# EAGLE design emonTx V3.4.5 (EAGLE 9.6.2)
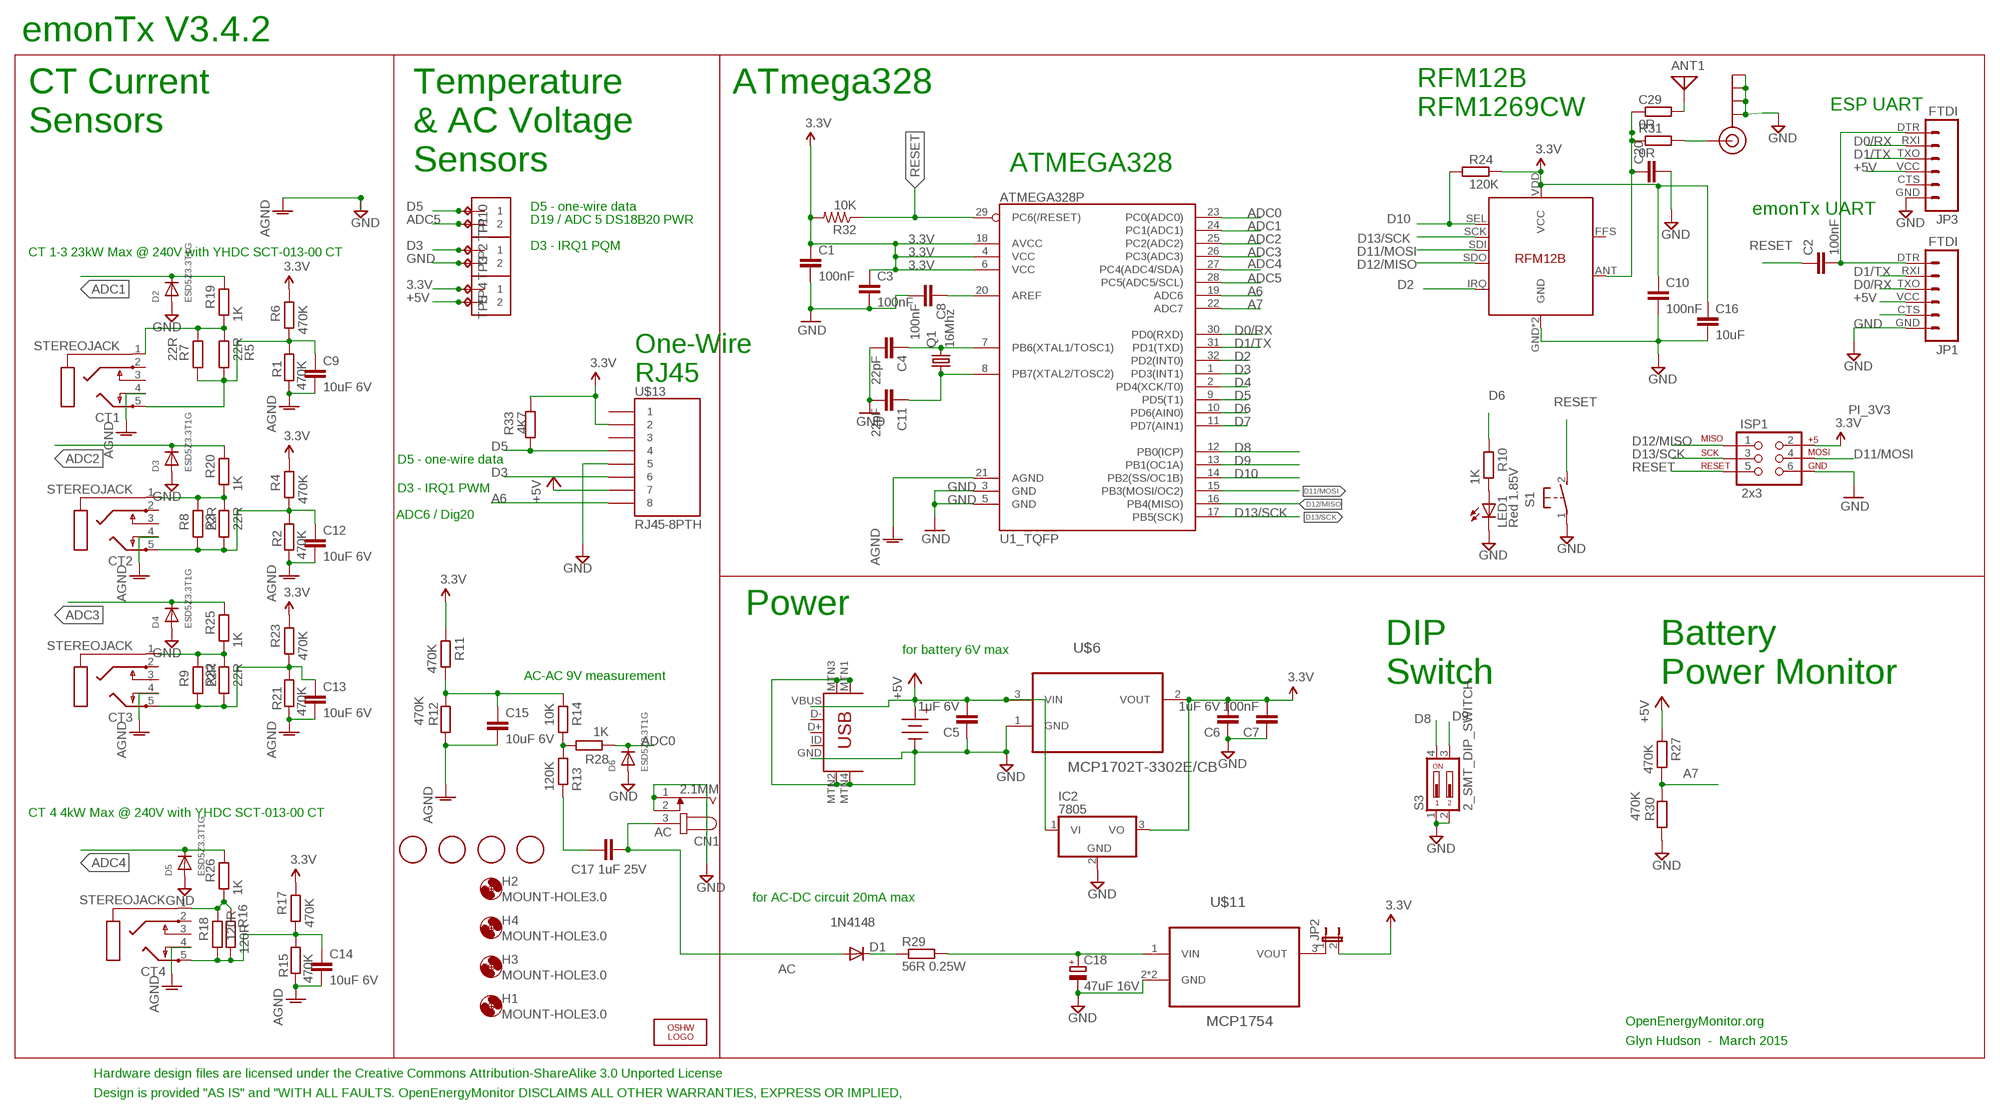
[diagram p0: schematic, sheet 1]

## Parts
ANT1  ANTENNA  [PAD-01]
C1  100nF  C-EUC0603  [C0603]
C2  100nF  C-EUC0603  [C0603]
C3  100nF  C-EUC0603  [C0603]
C4  22pF  C-EUC0603  [C0603]
C5  1uF 6V  C-EUC0603  [C0603]
C6  1uF 6V  C-EUC0603  [C0603]
C7  100nF  C-EUC0603  [C0603]
C8  100nF  C-EUC0603  [C0603]
C9  10uF 6V  C-EUC0603  [C0603]
C10  100nF  C-EUC0603  [C0603]
C11  22pF  C-EUC0603  [C0603]
C12  10uF 6V  C-EUC0603  [C0603]
C13  10uF 6V  C-EUC0603  [C0603]
C14  10uF 6V  C-EUC0603  [C0603]
C15  10uF 6V  C-EUC0603  [C0603]
C16  10uF  C-EUC0603  [C0603]
C17  1uF 25V  C-EUC0603  [C0603]
C18  47uF 16V  CPOL-EUD  [PANASONIC_D]
C20  ant tune?  C-EUC0603  [C0603]
C29  0R  R-EU_R0603  [R0603]
CN1  2.1MM  JACK-PLUG0  [SPC4077]
CT1  STEREOJACK  [STX3100]
CT2  STEREOJACK  [STX3100]
CT3  STEREOJACK  [STX3100]
CT4  STEREOJACK  [STX3100]
D1  1N4148  DIODESOD  [SOD-323]
D2  ESD5Z3.3T1G  DIODESOD-523  [SOD-523]
D3  ESD5Z3.3T1G  DIODESOD-523  [SOD-523]
D4  ESD5Z3.3T1G  DIODESOD-523  [SOD-523]
D5  ESD5Z3.3T1G  DIODESOD-523  [SOD-523]
D6  ESD5Z3.3T1G  DIODESOD-523  [SOD-523]
H1  MOUNT-HOLE3.0  [3,0]
H2  MOUNT-HOLE3.0  [3,0]
H3  MOUNT-HOLE3.0  [3,0]
H4  MOUNT-HOLE3.0  [3,0]
IC2  7805  7812TV  [TO220V]
ISP1  2x3  AVR_SPI_PRG_6PTH  [2X3]
J3  1X2-3.5MM  [1X2-3.5MM]
J5  1X2-3.5MM  [1X2-3.5MM]
J6  1X2-3.5MM  [1X2-3.5MM]
J$1  SMA_EDGE  [SMA-EDGE]
JP1  FTDI  FTDI_BASICPTH  [FTDI_BASIC]
JP2  JUMPER-2PTH_LOCK  [1X02_LOCK]
JP3  FTDI  FTDI_BASICPTH  [FTDI_BASIC]
LED1  Red 1.85V  LEDCHIP-LED0805  [CHIP-LED0805]
LOGO1  OSHW_LOGO_6MILX0200-NT  [OSHW_6X200_NOTEXT]
Q1  16Mhz  CRYSTALHC49UP  [HC49UP]
R1  470K  R-EU_R0603  [R0603]
R2  470K  R-EU_R0603  [R0603]
R3  22R  R-EU_0204/7  [0204/7]
R4  470K  R-EU_R0603  [R0603]
R5  22R  R-EU_0204/7  [0204/7]
R6  470K  R-EU_R0603  [R0603]
R7  22R  R-EU_R1206  [R1206]
R8  22R  R-EU_R1206  [R1206]
R9  22R  R-EU_R1206  [R1206]
R10  1K  R-EU_R0603  [R0603]
R11  470K  R-EU_R0603  [R0603]
R12  470K  R-EU_R0603  [R0603]
R13  120K  R-EU_R0603  [R0603]
R14  10K  R-EU_R0603  [R0603]
R15  470K  R-EU_R0603  [R0603]
R16  120R  R-EU_0204/7  [0204/7]
R17  470K  R-EU_R0603  [R0603]
R18  120R  R-EU_R1206  [R1206]
R19  1K  R-EU_R0603  [R0603]
R20  1K  R-EU_R0603  [R0603]
R21  470K  R-EU_R0603  [R0603]
R22  22R  R-EU_0204/7  [0204/7]
R23  470K  R-EU_R0603  [R0603]
R24  120K  R-EU_R0603  [R0603]
R25  1K  R-EU_R0603  [R0603]
R26  1K  R-EU_R0603  [R0603]
R27  470K  R-EU_R0603  [R0603]
R28  1K  R-EU_R0603  [R0603]
R29  56R 0.25W  R-EU_R1206  [R1206]
R30  470K  R-EU_R0603  [R0603]
R31  0R  R-EU_R0603  [R0603]
R32  10K  R-US_R0603  [R0603]
R33  4K7  R-EU_R0603  [R0603]
S1  31-XX  [B3F-31XX]
S3  2_SMT_DIP_SWITCH  [DIP_SWITCH_SMT]
TP1  TPPAD1-13  [P1-13]
TP2  TPPAD1-13  [P1-13]
TP3  TPPAD1-13  [P1-13]
TP4  TPPAD1-13  [P1-13]
TP5  TPPAD1-13  [P1-13]
TP10  TPPAD1-13  [P1-13]
U1_TQFP  ATMEGA328P  ATMEGA328_SMT  [TQFP32-08]
U$1  FIDUCIAL  [FIDUCIAL_1MM]
U$3  4.5V  3X_AAA_BATTERY_HOLDER  [AAA_PCB_HOLDER]
U$4  FIDUCIAL  [FIDUCIAL_1MM]
U$5  FIDUCIAL  [FIDUCIAL_1MM]
U$6  MCP1702T-3302E/CB  MCP1700T-3302E/TT  [SOT95P237X112-3N]
U$7  FIDUCIAL  [FIDUCIAL_1MM]
U$10  USB-MINIB-5PIN  [USB-MINIB-CISECO]
U$11  MCP1754  [SOT89]
U$13  RJ45-8PTH  [RJ45-8]
U$14  RFM12B  [RFM12B]

## Nets
3.3V: C1.1 C3.1 C6.2 C7.2 C10.1 C16.1 IC2.3(VO) ISP1.2 J6.1 JP2.2 R4.2 R6.2 R11.2 R17.2 R23.2 R24.2 R32.2 R33.1 TP4.TP U1_TQFP.4(VCC) U1_TQFP.6(VCC) U1_TQFP.18(AVCC) U$6.2(VOUT) U$13.2 U$14.VDD(VCC)
+5V [power]: C5.2 IC2.1(VI) J6.2 JP1.VCC JP3.VCC R27.2 TP5.TP U$3.+ U$6.3(VIN) U$10.VBUS U$13.7
A6: U1_TQFP.19(ADC6) U$13.8
A7: R27.1 R30.2 U1_TQFP.22(ADC7)
AC: C17.2 CN1.3 D1.2(A)
ADC0: D6.K(C) R28.1 U1_TQFP.23(PC0(ADC0))
ADC1: D2.K(C) R19.2 U1_TQFP.24(PC1(ADC1))
ADC2: D3.K(C) R20.2 U1_TQFP.25(PC2(ADC2))
ADC3: D4.K(C) R25.2 U1_TQFP.26(PC3(ADC3))
ADC4: D5.K(C) R26.2 U1_TQFP.27(PC4(ADC4/SDA))
ADC5: J3.2 TP1.TP U1_TQFP.28(PC5(ADC5/SCL))
AGND [gnd]: C9.2 C12.2 C13.2 C14.2 C15.2 CT1.4 CT2.4 CT3.4 CT4.4 R1.2 R2.2 R12.1 R15.2 R21.2 U1_TQFP.21(AGND)
D0/RX: JP1.TXO JP3.RXI U1_TQFP.30(PD0(RXD))
D1/TX: JP1.RXI JP3.TXO U1_TQFP.31(PD1(TXD))
D2: U1_TQFP.32(PD2(INT0)) U$14.IRQ
D3: J5.1 TP2.TP U1_TQFP.1(PD3(INT1)) U$13.6
D4: U1_TQFP.2(PD4(XCK/T0))
D5: J3.1 R33.2 TP10.TP U1_TQFP.9(PD5(T1)) U$13.4
D6: R10.2 U1_TQFP.10(PD6(AIN0))
D7: U1_TQFP.11(PD7(AIN1))
D8: S3.4 U1_TQFP.12(PB0(ICP))
D9: S3.3 U1_TQFP.13(PB1(OC1A))
D10: R24.1 U1_TQFP.14(PB2(SS/OC1B)) U$14.SEL
D11/MOSI: ISP1.4 U1_TQFP.15(PB3(MOSI/OC2)) U$14.SDI
D12/MISO: ISP1.1 U1_TQFP.16(PB4(MISO)) U$14.SDO
D13/SCK: ISP1.3 U1_TQFP.17(PB5(SCK)) U$14.SCK
DIG1: C20.1 C29.1 R31.1 U$14.ANT
GND [gnd]: C1.2 C3.2 C4.2 C5.1 C6.1 C7.1 C8.2 C10.2 C11.2 C16.2 C18.- C20.2 CN1.1 CN1.2 D2.A D3.A D4.A D5.A D6.A IC2.2(GND) ISP1.6 J5.2 J$1.GND@0(GND) J$1.GND@1(GND) J$1.GND@2(GND) J$1.GND@3(GND) JP1.GND JP3.GND LED1.C R30.1 S1.1(P) S3.1 S3.2 TP3.TP U1_TQFP.3(GND) U1_TQFP.5(GND) U$3.- U$6.1(GND) U$10.GND U$10.MTN1(MTN2) U$10.MTN2(MTN3) U$10.MTN3(MTN1) U$10.MTN4 U$11.2(GND) U$11.2.1(GND) U$13.5 U$14.GND U$14.P$12(GND) ; supply symbol labelled AGND
N$1: C4.1 Q1.2 U1_TQFP.7(PB6(XTAL1/TOSC1))
N$2: CT1.1 R5.2 R7.2 R19.1
N$3: C13.1 CT3.5 R9.1 R21.1 R22.1 R23.1
N$4: R13.2 R14.1 R28.2
N$5: JP2.1 U$11.3(VOUT)
N$6: C18.+ R29.2 U$11.1(VIN)
N$7: C17.1 R13.1
N$8: CT4.1 R16.2 R18.2 R26.1
N$9: C11.1 Q1.1 U1_TQFP.8(PB7(XTAL2/TOSC2))
N$10: CT2.1 R3.2 R8.2 R20.1
N$11: ANT1.1 C29.2
N$12: D1.1(C) R29.1
N$13: CT3.1 R9.2 R22.2 R25.1
N$19: JP1.CTS
N$20: C8.1 U1_TQFP.20(AREF)
N$23: C2.2 JP1.DTR JP3.DTR
N$24: J$1.SIG(SIGNAL) R31.2
N$33: C12.1 CT2.5 R2.1 R3.1 R4.1 R8.1
N$34: C15.1 R11.1 R12.2 R14.2
N$37: C14.1 CT4.5 R15.1 R16.1 R17.1 R18.1
N$38: C9.1 CT1.5 R1.1 R5.1 R6.1 R7.1
N$41: LED1.A R10.1
RESET: C2.1 ISP1.5 R32.1 S1.2(S) U1_TQFP.29(PC6(/RESET))
Unconnected: CT1.2 CT1.3 CT2.2 CT2.3 CT3.2 CT3.3 CT4.2 CT4.3 JP3.CTS U$10.D+ U$10.D- U$10.ID U$13.1 U$13.3 U$14.FFS

## Notes on the sheet
- emonTx V3.4.2
- ATmega328
- ESP UART
- RFM12B
  RFM1269CW
- CT Current 
  Sensors
- Temperature 
  & AC Voltage
  Sensors
- ATMEGA328
- D5 - one-wire data
- emonTx UART
- D19 / ADC 5 DS18B20 PWR
- D3 - IRQ1 PQM
- CT 1-3 23kW Max @ 240V with YHDC SCT-013-00 CT
- One-Wire
  RJ45
- D5 - one-wire data
- D3 - IRQ1 PWM
- ADC6 / Dig20
- Power
- for battery 6V max
- AC-AC 9V measurement
- DIP
  Switch
- Battery 
  Power Monitor
- CT 4 4kW Max @ 240V with YHDC SCT-013-00 CT
- for AC-DC circuit 20mA max
- OpenEnergyMonitor.org
- Glyn Hudson  -  March 2015
- Hardware design files are licensed under the Creative Commons Attribution-ShareAlike 3.0 Unported License
- Design is provided "AS IS" and "WITH ALL FAULTS. OpenEnergyMonitor DISCLAIMS ALL OTHER WARRANTIES, EXPRESS OR IMPLIED,

## Library data of the parts
ANT1 = discrete:ANTENNA: Antenna
C1 C2 C10 C16 C20 = rcl:C-EU: CAPACITOR, European symbol
C3-C9 C11-C15 C17 = resistor:C-EU: CAPACITOR, European symbol
C18 = resistor:CPOL-EU: POLARIZED CAPACITOR, European symbol
C29 R29 R31 = resistor:R-EU_: RESISTOR, European symbol
CN1 = con-jack:JACK-PLUG: DC POWER JACK Power Jack, DC, Right Angle, Through Hole, Rated 5A at 16VDC, PC Terminals Distributor: Farnell (www.Farnell.de) Drawing: 84N1161.pdf / 84N1162.pdf Manufacturer: SPC Technology (www.spctechnology.com) Type: SPC4077 / SPC 4078; OC_FARNELL: unknown; OC_NEWARK: unknown
CT1-CT4 = adafruit:STEREOJACK: MIC/HEADPHONE JACK Stereo jack with two switches. Kycon STX3100, CUI SJ1-3555NG and/or 4UCon 05544
D1 = SparkFun:DIODE: Diode
D2-D6 = microbuilder:DIODE: Diode
H1-H4 = holes:MOUNT-HOLE: MOUNTING HOLE with drill center marker
IC2 = linear:78*: Positive VOLTAGE REGULATOR Source: http://cache.national.com/ds/LM/LM78L05.pdf http://www.fairchildsemi.com/ds/LM/LM7805.pdf
ISP1 = SparkFun:AVR_SPI_PRG_6: AVR ISP 6 Pin This is the reduced ISP connector for AVR programming. Common on Arduino. This footprint will take up less PCB space and can be used with a 10-pin to 6-pin adapter such as SKU: BOB-08508
J3 J5 J6 = adafruit:1X2: 3.5mm Terminal block http://www.ladyada.net/library/pcb/eaglelibrary.html
J$1 = SparkFun-Connectors:SMA_EDGE: SMA Antenna Connector End launch SMA connector. The paste layer has been removed so that the connector can be hand soldered onto the board after reflow.
JP1 JP3 = SparkFun:FTDI_BASIC: FTDI Basic: 3.3V and 5V
JP2 = SparkFun:JUMPER-2: Jumper Basic 0.1" spaced jumper. Use with breakaway headers.
LED1 = adafruit:LED: LED OSRAM: - CHIPLED LG R971, LG N971, LY N971, LG Q971, LY Q971, LO R971, LY R971 LH N974, LH R974 LS Q976, LO Q976, LY Q976 LO Q996 - Hyper CHIPLED LW Q18S LB Q993, LB Q99A, LB R99A - SideLED LS A670, LO A670, LY A670, LG A670, LP A670 LB A673, LV A673, LT A673, LW A673 LH A674 LY A675 LS A676, LA A676, LO A676, LY A676, LW A676 LS A679, LY A679, LG A679 - Hyper Micro SIDELED® LS Y876, LA Y876, LO Y876, LY Y876 LT Y87S - SmartLED LW L88C, LW L88S LB L89C, LB L89S, LG L890 LS L89K, LO L89K, LY L89K LS L896, LA L896, LO L896, LY L896 - TOPLED LS T670, LO T670, LY T670, LG T670, LP T670 LSG T670, LSP T670, LSY T670, LOP T670, LYG T670 LG T671, LOG T671, LSG T671 LB T673, LV T673, LT T673, LW T673 LH T674 LS T676, LA T676, LO T676, LY T676, LB T676, LH T676, LSB T676, LW T676 LB T67C, LV T67C, LT T67C, LS T67K, LO T67K, LY T67K, LW E67C LS E67B, LA E67B, LO E67B, LY E67B, LB E67C, LV E67C, LT E67C LW T67C LS T679, LY T679, LG T679 LS T770, LO T770, LY T770, LG T770, LP T770 LB T773, LV T773, LT T773, LW T773 LH T774 LS E675, LA E675, LY E675, LS T675 LS T776, LA T776, LO T776, LY T776, LB T776 LHGB T686 LT T68C, LB T68C - Hyper Mini TOPLED® LB M676 - Mini TOPLED Santana® LG M470 LS M47K, LO M47K, LY M47K Source: http://www.osram.convergy.de/
LOGO1 = ohw-logo:OSHW_LOGO_6MIL
Q1 = adafruit:CRYSTAL: CRYSTAL; OC_FARNELL: unknown; OC_NEWARK: unknown
R1-R28 R30 R33 = rcl:R-EU_: RESISTOR, European symbol
R32 = adafruit:R-US_: RESISTOR, American symbol
S1 = adafruit:31-XX: OMRON SWITCH Now with beefier pads!
S3 = OpenEnergyMonitor:2_SMT_DIP_SWITCH: Multicomp MCEMR-02-T 2 throw SMT DIP switch, Farnell 1524005
TP1-TP5 TP10 = testpad:TP: Test pad
U1_TQFP = SparkFun-DigitalIC:ATMEGA328_SMT: 32-Pin Atmega328 part Commonly used on Arduino compatible boards Available in QFP and QFN packages TQFP is IC-09069 QFN is non-stock; PROD_ID: IC-09069
U$1 U$4 U$5 U$7 = adafruit:FIDUCIAL: For use by pick and place machines to calibrate the vision/machine, 1mm By microbuilder.eu
U$3 = Battery Holders:3X_AAA_BATTERY_HOLDER: 3x AA Battery Holder; RAPID_OC: 18-2967
U$6 = Farnell_MCP1700:MCP1700T-3302E/TT: Low Quiescent Current LDO; MPN: MCP1700T-3302E/TT; OC_FARNELL: 1296592; OC_NEWARK: 88H9817; PACKAGE: SOT23-3; SUPPLIER: Microchip
U$10 = Ciseco USB miniB_Updated:USB-MINIB: Mini-USB "B" connector with 5th pin broken out. Created new symbol breaking out 5th "ID" pin in mini/micro USB connector spec. See: http://en.wikipedia.org/wiki/Mini_usb#Cables. Uses same footprint as 4-pin symbol. Also added pins to connect to mounting / shield pads if required (probably not generally needed as signals aren't shielded once they leave the connector). Modified by Ciseco for Rapid Part 24-0357
U$11 = OpenEnergyMonitor:MCP1754
U$13 = SparkFun-Connectors:RJ45-8: RJ45 Jack Simple RJ45, 8-pin connection - connector for common Cat5, Cat5e, and Cat6 Ethernet cables. Footprint not yet proven in production. Connector sku is PRT-00643; Breakout PCB sku is BOB-00716.
U$14 = JeeParts:RFM12B

## Net classes
0 default: width 0.203 mm, drill 0.6 mm, clearance 0.203 mm
1 power: width 0.305 mm, drill 0.6 mm, clearance 0.254 mm
2 gnd: width 0.254 mm, drill 0.6 mm, clearance 0.254 mm

## Board
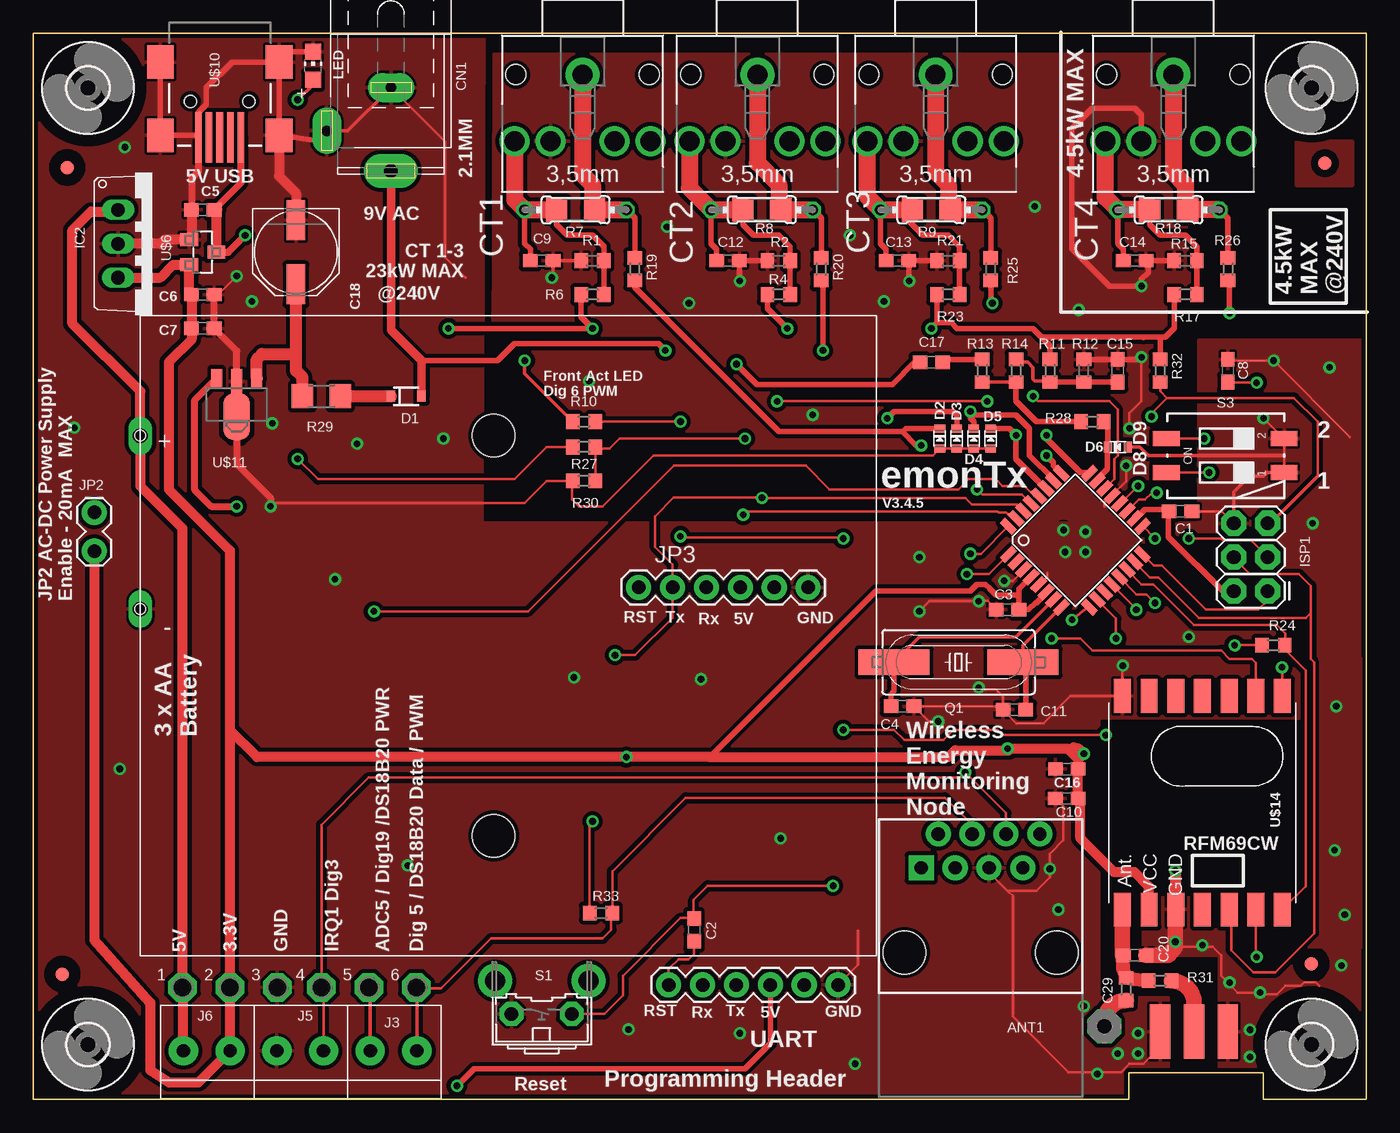
[diagram p1: board, top side]
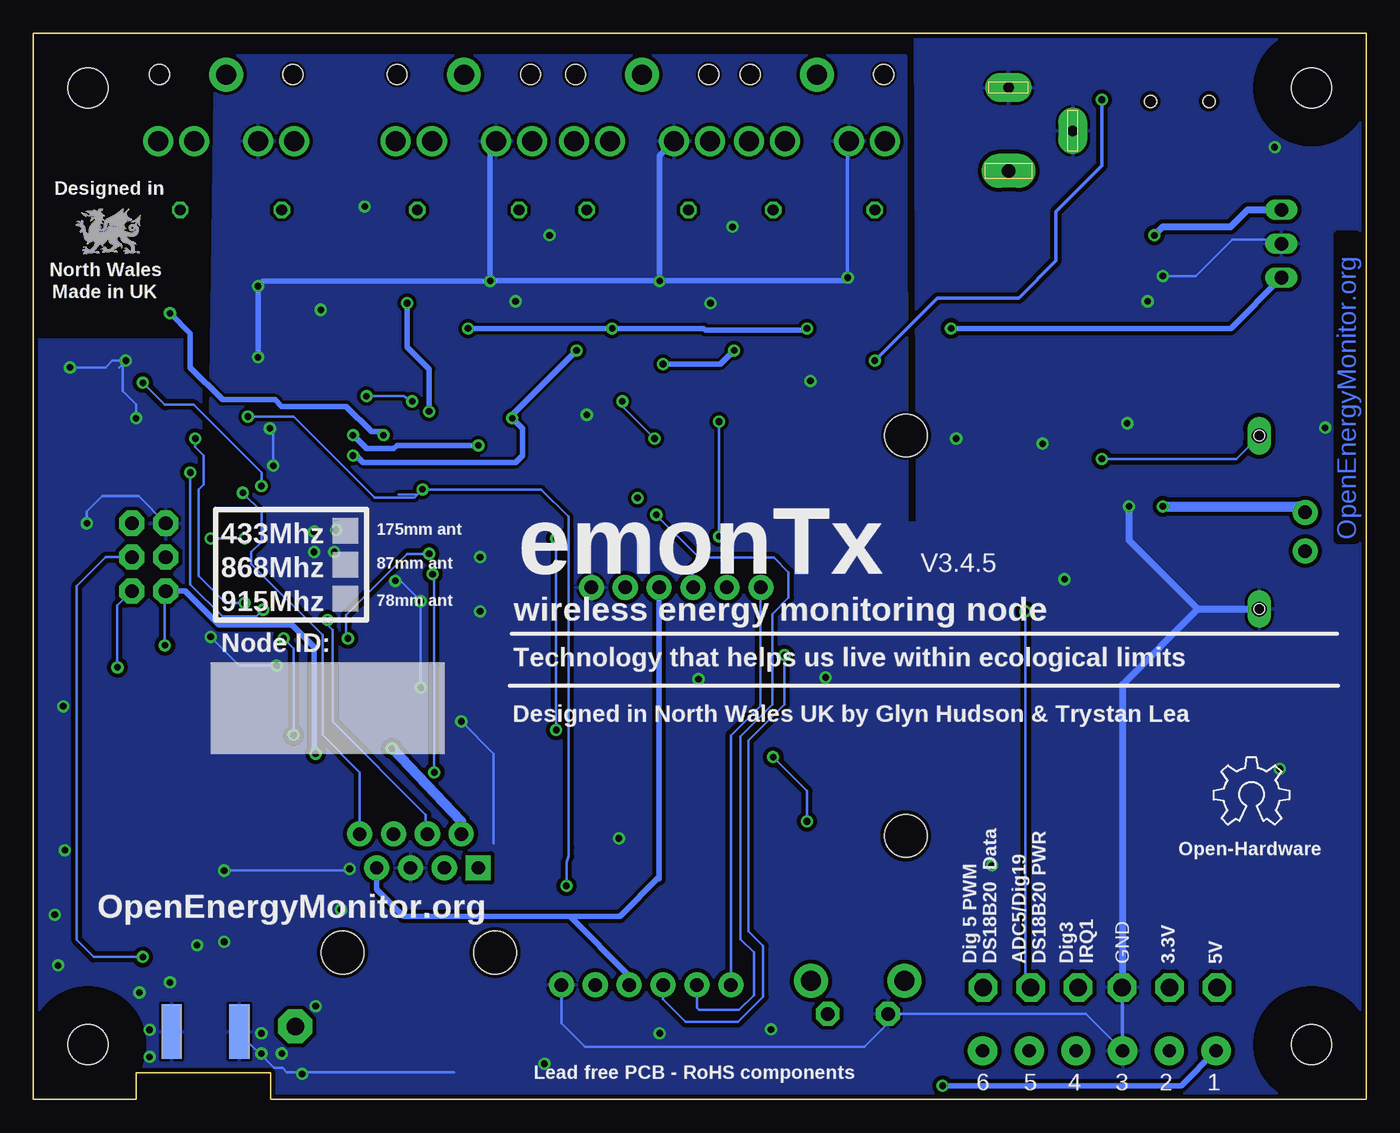
[diagram p2: board, bottom side, seen from below]

Size 99.9 x 79.91 mm. Coordinates in mm from the lower left corner, seen from the top.
Outline: 0,79.91 0,0.01 82.1,0 82.1,2 92.2,2 92.2,0.01 99.9,0.01 99.9,79.91 0,79.91
Copper layers (1*16): Top 0.035mm / dielectric 1.5mm / Bottom 0.035mm
Design rules "default *": minimum track width 8mil, minimum drill 0.5mm, track to track 8mil, track to pad 8mil, pad to pad 8mil, via to via 10mil, smd to smd 7mil, copper to edge 8mil, drill to drill 8mil, minimum pad ring 8mil, minimum via ring 8mil, stop-mask expansion 0.075mm, vias tented up to drill 0.6mm, thermal gap 8mil

### Footprints (pad centres in the part's own frame; a part is rotated, then mirrored left to right if it is on the bottom)
PAD-01 = drill 1.321 pad 2.54 octagon: 1 0,0
C0603 = smd 1.1 x 1: 1 -0.85,0; 2 0.85,0
PANASONIC_D = smd 3 x 1.4: + 2.4,0; - -2.4,0
R0603 = smd 1 x 1.1: 1 -0.85,0; 2 0.85,0
SPC4077 = drill 0.8 pad 2.184 long: 1 -3.25,0; 2 0,-4.8 | drill 1 pad 2.54 long: 3 3,0
STX3100 = drill 1.5 pad 2.54: 1 2.7,-0.1 | drill 1.5: 2 7.7,5; 3 7.7,2.3; 4 7.7,-2.5; 5 7.7,-5.2 | hole 1.5: 2.7,4.9; 2.7,-5.1
SOD-323 = smd 0.63 x 0.83: 1 -1.15,0; 2 1.15,0
SOD-523 = smd 0.8 x 0.6: A 0,-0.75; K 0,0.75
3,0 = hole 3: 0,0
TO220V = drill 1.016 long: 1 -2.54,-2.54; 2 0,-2.54; 3 2.54,-2.54
2X3 = drill 1.016 pad 1.88 octagon: 1 0,0; 2 0,2.54; 3 2.54,0; 4 2.54,2.54; 5 5.08,0; 6 5.08,2.54
1X2-3.5MM = drill 1 pad 2.184: 1 1.8,0; 2 -1.7,0
SMA-EDGE = smd 1.524 x 4.064: GND@0 0,0; GND@1 5.08,0; SIG 2.54,0 | smd 1.524 x 4.064 bottom: GND@2 0,0; GND@3 5.08,0
FTDI_BASIC = drill 1.016 pad 1.88: CTS 10.16,0; DTR 0,0; GND 12.7,0; RXI 2.54,0; TXO 5.08,0; VCC 7.62,0
1X02_LOCK = drill 1.016 pad 1.88: 1 -0.178,0; 2 2.718,0
CHIP-LED0805 = smd 1.2 x 1.2: A 0,-1.05; C 0,1.05
HC49UP = smd 5.334 x 1.93: 1 -4.826,0; 2 4.826,0
0204/7 = drill 0.813 octagon: 1 -3.81,0; 2 3.81,0
R1206 = smd 1.6 x 1.803: 1 -1.422,0; 2 1.422,0
B3F-31XX = drill 1.016 pad 1.778 octagon: 1 -2.261,-1.245; 2 2.261,-1.245 | drill 1.499 pad 2.54: 3 -3.505,1.245; 4 3.505,1.245
DIP_SWITCH_SMT = smd 1.1 x 2: 1 -1.27,-4.215; 2 1.27,-4.215; 3 1.27,4.615; 4 -1.27,4.615
P1-13 = drill 1.321 pad 2.159 octagon: TP 0,0
TQFP32-08 = smd 1.27 x 0.559: 1 -4.293,2.8; 2 -4.293,2; 3 -4.293,1.2; 4 -4.293,0.4; 5 -4.293,-0.4; 6 -4.293,-1.2; 7 -4.293,-2; 8 -4.293,-2.8; 17 4.293,-2.8; 18 4.293,-2; 19 4.293,-1.2; 20 4.293,-0.4; 21 4.293,0.4; 22 4.293,1.2; 23 4.293,2; 24 4.293,2.8 | smd 0.559 x 1.27: 9 -2.8,-4.293; 10 -2,-4.293; 11 -1.2,-4.293; 12 -0.4,-4.293; 13 0.4,-4.293; 14 1.2,-4.293; 15 2,-4.293; 16 2.8,-4.293; 25 2.8,4.293; 26 2,4.293; 27 1.2,4.293; 28 0.4,4.293; 29 -0.4,4.293; 30 -1.2,4.293; 31 -2,4.293; 32 -2.8,4.293
FIDUCIAL_1MM = smd 1 x 1: 1 0,0
AAA_PCB_HOLDER = drill 1.1 pad 1.778 long: + 29,-15; - 29,-2 | hole 0.8: 29,-15; 29,-2 | hole 3.2: 2.5,15; 2.5,-15
SOT95P237X112-3N = smd 0.991 x 1.321: 1 -0.94,-1.016; 2 0.94,-1.016; 3 0,1.016
USB-MINIB-CISECO = smd 3.8 x 0.5: D+ 7.9,0; D- 7.9,0.8; GND 7.9,-1.6; ID 7.9,-0.8; VBUS 7.9,1.6 | smd 2.5 x 2: MTN1 2.25,4.45; MTN2 7.75,4.45; MTN3 2.25,-4.45; MTN4 7.75,-4.45 | hole 0.9: 5.2,2.2; 5.2,-2.2
SOT89 = smd 0.8 x 1.4: 1 -1.499,-1.981; 3 1.499,-1.981 | smd 0.8 x 1.9: 2 0,-1.727 | smd 2 x 3.5: 2.1 0,0.889
RJ45-8 = drill 1 pad 1.88 square: 1 -4.445,6.35 | drill 1 pad 1.88: 2 -3.175,8.89; 3 -1.905,6.35; 4 -0.635,8.89; 5 0.635,6.35; 6 1.905,8.89; 7 3.175,6.35; 8 4.445,8.89 | hole 3.2: -5.715,0; 5.715,0
RFM12B = smd 2.54 x 1.27: ANT 8,-6; FFS -8,2; GND 8,-2; IRQ -8,4; P$8 -8,0; P$9 -8,-2; P$10 -8,-4; P$12 -8,-6; P$16 8,0; SCK 8,4; SDI 8,2; SDO -8,6; SEL 8,6; VDD 8,-4

### Placement (x,y rotation side)
ANT1  80.26,5.46 0 top
C1  85.98,44.07 0 top
C2  49.53,12.7 270 top
C3  73.03,36.7 180 top
C4  65.15,29.46 0 top
C5  12.7,66.68 0 top
C6  12.7,60.33 180 top
C7  12.7,57.79 180 top
C8  89.53,54.61 90 top
C9  38.1,62.87 0 top
C10  77.45,22.56 180 top
C11  73.53,29.21 180 top
C12  52.07,62.87 0 top
C13  64.77,62.87 0 top
C14  82.55,62.87 0 top
C15  81.28,54.61 90 top
C16  77.47,24.77 180 top
C17  67.31,55.25 180 top
C18  19.68,63.5 270 top
C20  82.55,10.79 0 top
C29  81.92,8.26 270 top
CN1  26.8,72.6 270 top
CT1  41.27,79.52 270 top
CT2  54.37,79.52 270 top
CT3  67.73,79.52 270 top
CT4  85.54,79.52 270 top
D1  27.94,52.71 0 top
D2  67.94,49.53 0 top
D3  69.22,49.53 0 top
D4  70.48,49.53 0 top
D5  71.75,49.53 0 top
D6  81.28,48.9 90 top
H1  4.1,75.81 0 top
H2  95.8,75.81 0 top
H3  4.1,4.11 0 top
H4  95.8,4.11 0 top
IC2  8.89,64.14 270 top
ISP1  92.52,38.1 90 top
J3  26.95,3.64 0 top
J5  19.95,3.64 0 top
J6  12.95,3.64 0 top
J$1  89.53,5.08 180 top
JP1  47.62,8.58 0 top
JP2  4.57,43.82 270 top
JP3  45.37,38.37 0 top
LED1  20.95,77.47 0 top
LOGO1  11.43,20.57 0 bottom
Q1  69.34,32.77 180 top
R1  41.91,62.87 180 top
R2  55.88,62.87 180 top
R3  54.61,66.68 0 top
R4  55.88,60.33 180 top
R5  40.64,66.68 0 top
R6  41.91,60.33 180 top
R7  40.64,66.68 0 top
R8  54.61,66.68 0 top
R9  67.31,66.68 0 top
R10  41.27,50.8 0 top
R11  76.2,54.61 90 top
R12  78.74,54.61 270 top
R13  71.12,54.61 270 top
R14  73.66,54.61 90 top
R15  86.36,62.87 180 top
R16  85.09,66.68 0 top
R17  86.36,60.33 180 top
R18  85.09,66.68 0 top
R19  45.09,62.23 270 top
R20  59.05,62.23 270 top
R21  68.58,62.87 180 top
R22  67.31,66.68 0 top
R23  68.58,60.33 180 top
R24  92.95,34.05 180 top
R25  71.75,62.23 270 top
R26  89.53,62.23 270 top
R27  41.27,48.9 180 top
R28  79.37,50.8 180 top
R29  21.59,52.71 180 top
R30  41.27,46.35 0 top
R31  84.45,8.89 0 top
R32  84.45,54.61 90 top
R33  42.55,13.97 0 top
S1  38.1,7.65 0 top
S3  89.53,48.26 90 top
TP1  25.15,8.38 0 top
TP2  21.59,8.38 0 top
TP3  18.29,8.38 0 top
TP4  14.73,8.38 0 top
TP5  11.18,8.38 0 top
TP10  28.7,8.38 0 top
U1_TQFP  78.11,41.91 45 top
U$1  95.79,10.16 0 top
U$3  37.01,34.75 180 top
U$4  2.17,9.38 0 top
U$5  96.81,70.18 0 top
U$6  12.7,63.5 270 top
U$7  2.54,69.85 0 top
U$10  13.97,80.01 270 top
U$11  15.24,52.07 180 top
U$13  71,11 0 top
U$14  87.63,22.23 270 top

### Tracks (layer width: path | path; a pad name or v marks a point on that pad's centre or on a via)
3.3V  (via drill 0.5)
  Top 0.203: R24.2 90.06,34.05 v90.04,34.04 | U1_TQFP.4 74.84,39.16 | R33.1 41.7,20.61 v41.91,20.83
  Top 0.406: 41.06,59.48 R6.2 41.06,58.67 | 41.06,58.67 41.06,58.63 v41.91,57.78 | v31.11,57.78 v41.91,57.78 | 75.56,57.15 74.93,57.78 69.22,57.78 68.8,58.2 67.73,58.2 | 75.56,57.15 76.2,56.52 R11.2 | R4.2 55.03,59.27 v56.52,57.78 | R17.2 85.51,57.82 84.84,57.15 84.58,57.15 | 75.56,57.15 83.19,57.15 83.19,57.11 83.22,57.15 84.58,57.15 | R32.2 84.45,57.02 84.58,57.15 | C3.1 74.59,36.7 75.1,37.21 75.18,37.21 75.92,37.95 U1_TQFP.6 75.92,38.07 | U1_TQFP.4 74.72,39.16 74.72,39.09 73.88,38.25 73.88,37.59 | 73.91,36.74 C3.1 | U1_TQFP.18 82.65,43.53 83.31,44.2 85,44.2 C1.1 | 85,43.69 C1.1 | ISP1.2 89.15,38.1 85.09,42.16 85.09,43.78 C1.1 | C3.1 73.88,37.59 | v41.91,57.78 41.91,57.82 41.06,58.67 | R23.2 67.73,58.2 | 67.73,58.2 v67.31,57.78 | 73.88,37.59 73.67,37.8 72.14,37.8 71.69,38.25 71.69,38.3 71.37,38.61 70.74,38.61 70.23,38.1 63.15,38.1 50.7,25.65 | 78.36,26.29 78.23,26.42 77.98,26.42
  Top 0.508: C6.2 11.68,60.49 | 14.75,8.36 TP4.TP
  Top 0.762: IC2.3 9.53,61.6 10.49,62.56 U$6.2 11.68,60.49 | C6.2 C7.2 11.85,56.94 10.16,55.24 10.16,45.72 14.73,41.15 14.73,27.69 | JP2.2 4.57,11.94 8.76,7.24 8.76,2.16 10.16,1.27 12.38,1.27 J6.1 14.75,8.36 | 14.73,27.69 TP4.TP | 14.73,27.69 16.76,25.65 v44.45,25.65 50.7,25.65 68.58,25.65 69.09,26.16 73.15,26.16 v73.03,26.29 77.52,26.29 78.32,25.49 | U$14.VDD 83.63,15.94 82.55,17.02 81.03,17.02 78.49,19.56 78.49,22.37 C10.1 78.3,24.75 C16.1 78.32,25.49 | 78.32,25.49 v78.74,25.91 77.98,25.91 77.72,26.16 | 77.98,26.16 78.49,26.16 78.36,26.29 78.11,26.29 77.98,26.16 | 77.98,26.42 77.72,26.16 | 77.72,26.16 77.98,26.16
  Bottom 0.203: v90.04,34.04 90.04,38.04 ISP1.2 | v41.91,20.83 41.91,23.11 v44.45,25.65
  Bottom 0.406: v31.11,57.78 10.16,57.78 IC2.3 | ISP1.2 88.52,38.1 85.98,35.56 80.52,35.56 78.87,33.91 78.87,26.04 v78.74,25.91 | v41.91,57.78 42.04,57.66 49.53,57.66 49.66,57.78 v56.52,57.78 v67.31,57.78
  Bottom 0.762: U$13.2 67.83,20.84 v73.03,26.29
+5V  (via drill 0.5)
  Top 0.203: R27.2 38.48,48.9 36.07,46.48 21.34,46.48 v19.81,48.01
  Top 0.406: C5.2 13.97,66.68 | v31.75,1.02 33.02,2.29 53.34,2.29 55.24,4.19 JP1.VCC
  Top 0.508: U$10.VBUS 15.57,68.7 C5.2 13.72,66.51 | U$6.3 14.61,63.5 v15.88,64.77 | 11.18,3.71 J6.2
  Top 0.762: 13.72,66.51 U$6.3 | 11.18,3.71 TP5.TP 11.18,42.8 8.01,45.97 U$3.+ 8.01,53.08 2.92,58.17 2.92,65.15 4.32,66.55 6.22,66.55 IC2.1
  Bottom 0.203: v19.81,48.01 9.75,48.01 U$3.+
  Bottom 0.406: v31.75,1.02 13.87,1.02 J6.2 | 59.69,13.72 55.24,9.27 JP1.VCC | 59.69,13.72 72.14,13.72 74.17,15.75 U$13.7 | 52.99,16.67 JP3.VCC | 52.99,16.67 52.99,16.52 | 59.69,13.72 55.94,13.72 52.99,16.67
  Bottom 0.508: v15.88,64.77 15.24,65.41 10.16,65.41 8.89,66.68 IC2.1
A6  (via drill 0.5)
  Top 0.203: v84.2,45.47 83.82,45.47 83.31,44.96 82.85,44.96 U1_TQFP.19 81.94,44.1
  Bottom 0.203: U$13.8 75.44,24.52 78.23,27.3 78.23,34.8 83.57,40.13 83.57,41.02 82.8,41.78 82.8,44.07 v84.2,45.47
A7  (via drill 0.5)
  Top 0.203: R30.2 R27.1 | v74.93,52.7 75.31,52.32 80.64,52.32 81.28,51.69 81.28,48.26 81.03,48.01 81.03,46.48 80.34,45.79 U1_TQFP.22 80.29,45.62 | v71.5,52.32 v55.75,52.32 | 42.25,49.02 R27.1 | v53.34,49.53 43.94,49.53 43.18,48.77 42.25,48.77 R27.1
  Bottom 0.203: v74.93,52.7 72.14,52.7 v71.5,52.32 | v55.75,52.32 55.75,51.94 v53.34,49.53
AC  (via drill 0.5)
  Top 0.406: 29.09,55.37 34.79,55.37 36.07,56.64 46.86,56.64 v47.37,56.13 | C17.2 66.04,55.25 64.39,53.59 54.23,53.59 v52.7,55.12
  Top 0.635: CN1.3 26.8,57.66 29.09,55.37 D1.2
  Bottom 0.406: v52.7,55.12 48.39,55.12 v47.37,56.13
ADC0
  Top 0.203: U1_TQFP.23 79.73,46.33
  Top 0.406: U1_TQFP.23 79.73,46.45 80.52,47.24 80.52,48.88 D6.K 80.53,50.49 R28.1
ADC1  (via drill 0.5)
  Top 0.406: R19.2 45.09,60.83 55.88,50.04 65.15,50.04 | v75.95,49.78 75.95,49.53 78.49,46.99 79.1,46.99 U1_TQFP.24 | D2.K 65.39,50.28 65.15,50.04 | v66.55,49.02 66.17,49.02 65.15,50.04
  Bottom 0.406: v66.55,49.02 72.64,49.02 72.9,48.77 74.93,48.77 v75.95,49.78
ADC2  (via drill 0.5)
  Top 0.203: U1_TQFP.25 77.05,46.9 | R20.2 59.05,61.34 59.18,61.21
  Top 0.406: v59.18,56.13 59.18,61.21 59.18,61.25 | U1_TQFP.25 77.03,46.92 76.45,47.5 76.45,47.75 v75.95,48.26 | D3.K 69.22,51.31 68.96,51.56 64.52,51.56 v64.01,51.05
  Bottom 0.406: v59.18,56.13 64.01,51.31 v64.01,51.05 63.25,50.29 63.25,48.26 63.75,47.75 75.18,47.75 75.69,48.26 v75.95,48.26
ADC3  (via drill 0.5)
  Top 0.203: U1_TQFP.26 76.48,46.33
  Top 0.406: U1_TQFP.26 76.48,46.45 74.68,48.26 74.68,50.29 73.66,51.31 70.48,51.31 v70.23,51.56 70.23,51.05 70.48,50.8 D4.K | R25.2 71.75,59.82 v71.88,59.69
  Bottom 0.406: v71.88,59.69 71.88,56.39 70.23,54.74 v70.23,51.56
ADC4  (via drill 0.5)
  Top 0.203: U1_TQFP.27 75.92,45.62 | 89.66,61.25 R26.2
  Top 0.406: U1_TQFP.27 75.87,45.79 73.66,48.01 v73.66,49.78 73.16,50.28 D5.K | v89.66,58.93 89.66,61.25
  Bottom 0.406: v89.66,58.93 88.14,57.4 88.14,54.86 85.72,52.45 81.79,52.45 81.28,51.94 76.45,51.94 74.55,50.04 73.91,50.04 v73.66,49.78
ADC5  (via drill 0.5)
  Top 0.203: 75.35,45.17 U1_TQFP.28 75.04,45.23 74.3,45.97 72.64,45.97 72.14,46.48 70.1,46.48 69.34,45.72 59.69,45.72 57.91,47.5 48.01,47.5 37.08,36.58 v25.53,36.58
  Top 0.254: J3.2 25.25,8.28 TP1.TP
  Bottom 0.203: v25.53,36.58 25.53,8.76 TP1.TP
AGND  (via drill 0.5)
  Top 0.203: 82.93,55.5 v83.06,55.63 83.06,52.32 82.17,51.44 v82.17,50.29 | 80.26,44.42 80.26,44.7 80.79,45.23 U1_TQFP.21 80.86,45.3 81.92,46.35 v81.92,47.5
  Top 0.254: R1.2 C9.2 38.95,61.68 v38.86,61.59 v38.86,61.6
  Top 0.406: R12.1 C15.2 82.89,55.46 v83.06,55.63 | R15.2 C14.2 83.57,62.7 83.57,61.98 83.06,61.47 v83.06,60.96 80.64,60.96 77.85,63.75 77.85,72.77 79.38,74.3 82.55,74.3 83.04,73.81 CT4.4 | R21.2 C13.2 65.62,61.38 v65.66,61.34 | R2.2 C12.2 52.92,61.38 v52.96,61.34
  Bottom 0.203: v81.92,47.5 81.92,50.04 v82.17,50.29
  Bottom 0.254: v38.86,61.59 38.86,71.72 CT1.4
  Bottom 0.406: v83.06,55.63 v83.06,60.96 82.68,61.34 v65.66,61.34 | CT3.4 65.66,71.39 v65.66,61.34 | v52.96,61.34 52.96,70.72 CT2.4 | v38.86,61.59 39.08,61.38 65.62,61.38 v65.66,61.34
  other vias: 41.66,53.85 49.15,59.69 58.42,51.31 63.75,59.82 47.5,65.41 61.21,64.77 75.06,66.93 78.36,59.18
  pour Top (isolate 0.305): 34.54,78.36 34.41,42.86 86.73,42.86 86.23,78.36
  pour Bottom (isolate 0): 34.41,42.86 86.73,42.98 86.23,78.23 34.54,78.23
  pour Top: 84.84,78.36 91.44,78.36 91.44,58.8 84.84,58.8
  pour Bottom (isolate 0.305): 84.84,58.67 91.44,58.67 91.44,78.49 84.84,78.49
D0/RX  (via drill 0.5)
  Top 0.203: 74.22,44.02 U1_TQFP.30 73.74,44.58 70.36,44.58 69.85,45.09 54.74,45.09 | 54.74,45.09 v54.61,45.09 | v43.6,33.3 45.1,33.3 47.9,36.1 JP3.RXI 47.91,40.09 46.6,41.4 46.6,43.7 48,45.1 54.73,45.1 54.74,45.09
  Bottom 0.203: JP1.TXO 52.7,7.5 51,5.8 47.1,5.8 45.2,7.7 45.2,11.5 46.3,12.6 46.3,26.9 43.6,29.6 v43.6,33.3
D1/TX  (via drill 0.5)
  Top 0.203: 73.82,43.53 U1_TQFP.31 73.56,43.53 72.9,43.99 72.39,43.99 72.26,44.07 53.47,44.07 v53.21,43.81
  Bottom 0.203: JP1.RXI 50.16,6.86 50,6.7 47,6.7 45.9,7.8 45.9,11 46.9,12 46.9,27.2 44.5,29.6 44.5,36.4 43.3,37.6 43.3,39.5 44.4,40.6 49.8,40.6 | 49.8,40.6 50.5,39.9 50.5,38.42 JP3.TXO | 49.8,40.6 50,40.6 v53.21,43.81
D2  (via drill 0.5)
  Top 0.203: U$14.IRQ 91.63,32.7 91.31,33.02 89.66,33.02 89.03,33.66 79.38,33.66 78.49,34.54 v76.33,34.54 | v70.23,40.89 71.02,40.89 U1_TQFP.32
  Bottom 0.203: 76.33,34.8 v76.33,34.54 76.45,34.67 76.45,36.32 71.88,40.89 v70.23,40.89
D3  (via drill 0.5)
  Top 0.203: U$13.6 72.91,21.46 v69.85,24.51 69.47,24.13 25.15,24.13 21.59,20.57 TP2.TP 21.75,8.22 J5.1 | v69.98,39.37 71.61,39.37 U1_TQFP.1 73.11,40.85
  Bottom 0.203: v69.85,24.51 69.85,39.24 v69.98,39.37
D4
  Top 0.203: U1_TQFP.2 73.66,40.33
D5  (via drill 0.5)
  Top 0.203: U1_TQFP.9 79.06,36.9 v77.85,35.94 | U$13.4 70.48,20.01 70.48,20.45 68.33,22.61 48.9,22.61 43.4,17.11 R33.2 43.31,13.88 43.31,12.7 42.67,12.06 34.29,12.06 30.56,8.33 28.75,8.33
  Top 0.254: J3.1 28.75,8.33 TP10.TP
  Bottom 0.203: v77.85,35.94 77.85,35.56 77.47,35.18 77.47,28.32 70.48,21.34 70.48,20.01 U$13.4
D6  (via drill 0.5)
  Top 0.203: 79.73,37.49 U1_TQFP.10 81.15,36.03 v81.15,34.54 | R10.2 v48.51,50.8 | v48.5,42.2 48.6,42.1 60.64,42.1 v60.71,42.04 | v60.71,27.69 64.52,27.69 65.28,26.92 68.2,26.92 68.96,27.69 72.26,27.69 72.64,27.3 v80.39,27.3
  Bottom 0.203: 81.03,34.29 v81.15,34.54 80.39,33.78 v80.39,27.3 | v48.5,42.2 48.5,50.79 v48.51,50.8 | v60.71,42.04 v60.71,27.69
D7
  Top 0.203: U1_TQFP.11 80.29,38.07
D8  (via drill 0.5)
  Top 0.203: S3.4 v88.14,46.99 | v82.68,36.7 82.68,36.77 U1_TQFP.12 80.86,38.65
  Bottom 0.203: v88.14,46.99 88.14,38.61 85.72,36.2 83.19,36.2 v82.68,36.7
D9  (via drill 0.5)
  Top 0.203: v84.07,37.21 83.44,37.85 82.68,37.85 81.42,39.1 U1_TQFP.13 81.42,39.23 | v87.76,49.53 S3.3
  Bottom 0.203: v84.07,37.21 85.47,37.21 87.5,39.24 87.5,45.72 87.12,46.1 87.12,48.26 87.76,48.9 v87.76,49.53
D10
  Top 0.203: U$14.SEL 95.38,15.97 95.38,32.13 93.8,33.71 R24.1 93.85,34.1 93.85,34.92 93.22,35.56 87,35.56 83.95,38.61 83.06,38.61 81.99,39.68 U1_TQFP.14 81.94,39.72
D11/MOSI
  Top 0.203: ISP1.4 89.98,40.58 91.19,39.37 94.87,39.37 95.76,38.48 95.76,36.45 | 95.76,36.45 95.76,33.02 96.01,32.77 96.01,12.45 93.09,9.53 91.44,9.53 89.79,11.18 89.79,14.07 U$14.SDI | 95.76,36.45 95.38,36.07 87.38,36.07 84.33,39.12 83.69,39.12 82.56,40.25 U1_TQFP.15 82.52,40.29
D12/MISO  (via drill 0.5)
  Top 0.203: U$14.SDO 93.63,32.35 v93.6,32.38 | ISP1.1 92.52,37.4 91.82,36.7 87.88,36.7 84.58,40.01 83.97,40.01 U1_TQFP.16
  Bottom 0.203: v93.6,32.38 93.6,37.02 ISP1.1
D13/SCK  (via drill 0.5)
  Top 0.203: U$14.SCK 91.63,10.73 v91.69,10.67 | U1_TQFP.17 83.15,42.97 v84.07,42.04 | v86.61,42.04 89.03,42.04 89.15,41.91 91.25,41.91 ISP1.3
  Bottom 0.203: v91.69,10.67 95.38,10.67 96.65,11.94 96.65,38.48 94.49,40.64 ISP1.3 | v84.07,42.04 v86.61,42.04
DIG1
  Top 1.016: U$14.ANT arc-90 81.7,14.15 | R31.1 82.5,8.98 C29.1 81.66,9.78 arc90 81.66,10.03 81.66,10.76
  Top 1.143: U$14.ANT 81.63,10.87 arc90 C20.1 arc90 81.66,10.76
GND  (via drill 0.5)
  Top 0.203: U1_TQFP.3 74.22,39.68 73.41,38.86 v72.77,38.86 | C3.2 71.54,37.34 v70.87,37.34 67.18,37.34 v66.42,36.58 | C1.2 89.09,44.07 ISP1.6 | v17.78,44.45 18.03,44.7 36.83,44.7 38.48,46.35 R30.1 40.39,46.32 40.39,44.96 40.89,44.45 42.67,44.45 46.48,48.26 67.42,48.26 D2.A D3.A D4.A D5.A | C10.2 77.22,21.94 77.22,19.43 76.2,18.41 v76.2,17.27 76.2,16.64 75.18,15.62 73.03,15.62 | 85.63,17.11 v85.6,17.14 85.72,17.14 | 32.38,61.6 30.86,63.12 30.86,71.79 CN1.1 | C11.2 72.43,29.46 C4.2 67.14,28.32 v67.82,28.32 | C11.2 72.68,30.19 72.14,30.73 70.99,30.73 v70.87,30.86 | C11.2 73.7,28.19 75.69,28.19 77.72,30.23 U$14.P$12 81.63,32.48 v81.66,32.51 | U$13.5 71.64,17.01 73.03,15.62 | J$1.GND@1 84.45,3.94 83.19,2.67 82.17,2.67 81.53,2.03 77.6,2.03 73.41,6.22 73.41,15.24 73.03,15.62 | C6.1 13.85,60.33 v15.24,61.72 | C8.2 89.62,55.37 v92.96,55.37 98.68,49.66 | 96.39,8.51 96.14,8.76 95.25,8.76 95,8.51 93.85,8.51 93.22,7.87 92.46,7.87 92.33,8 90.3,8 89.03,9.27 89.03,10.79 88.39,11.43 85.98,11.43 85.63,11.78 U$14.GND 85.6,14.26 | U1_TQFP.5 75.45,38.59 76,39.14 76,39.45 | 61.82,12.62 61.82,10.08 JP1.GND | v92.2,51.05 93.47,49.78 93.47,49.53 S3.2 93.75,48.26 S3.1 93.39,46.59
  Top 0.254: 22.02,72.6 23.55,72.6 CN1.1 | D6.A 82.93,48.9 83.57,48.26 93.75,48.26 | ISP1.6 89.98,45.53 91.19,46.74 92.2,46.74 92.46,46.99 S3.1
  Top 0.406: C18.- | 22.02,72.6 CN1.2 21.26,71.86 U$10.MTN2 U$10.MTN1 | LED1.C 19.18,78.52 U$10.MTN1 | U$10.MTN3 U$10.MTN4 12.37,72.26 U$10.GND 12.37,73.97 12.95,74.55 12.95,75.82 14.89,77.76 U$10.MTN1
  Top 0.508: IC2.2 | U$10.GND 12.37,69.52 11.85,69 C5.1 | U$11.2 15.24,56.1 C7.1 C6.1 | U$11.2.1 15.24,47.62 17.78,45.09 v17.78,44.45
  Top 0.762: U$10.MTN2 18.42,69.21 19.68,67.94 C18.- | IC2.2 9.53,64.14 9.83,64.44 U$6.1 11.85,64.44 C5.1
  Top 0.813: v85.6,17.14 85.6,14.1
  Top 1.143: C20.2 85.09,10.79 85.6,11.43 85.6,14.1 85.6,14.13 U$14.GND
  Bottom 0.203: v72.77,38.86 72.52,38.99 v70.87,37.34 v70.87,30.86 | 76.07,17.14 v76.2,17.27 76.33,17.14 v85.6,17.14 | J5.2 21.02,6.4 S1.1 35.84,5.69 37.59,3.94 58.55,3.94 60.33,5.71 JP1.GND | 65.41,19.18 65.41,25.91 v67.82,28.32 | v15.24,61.72 12.75,61.72 10.03,64.44 6.65,64.44 IC2.2 | J$1.GND@1 84.45,4.95 81.85,2.35 81.22,2.35 80.9,2.03 68.36,2.03 | 93.47,54.86 v92.96,55.37 | v81.66,32.51 84.45,32.51 v86.61,34.67 | v92.2,51.05 92.2,52.07 93.22,53.09 93.22,55.12 v92.96,55.37 | v97.16,54.86 94.49,54.86 93.98,55.37 v92.96,55.37 | v95.89,43.18 95.89,44.07 94.74,45.21 92.01,45.21 ISP1.6
  Bottom 0.254: TP3.TP 18.29,3.67 J5.2
  Bottom 0.508: v17.78,44.45 17.78,41.91 12.62,36.75 | 12.62,36.75 U$3.- | 12.62,36.75 18.29,31.07 TP3.TP
  other vias: 44.61,5.24 52.96,4.95 61.59,2.67 78.87,41.02 77.22,42.67 97.54,18.67 97.66,29.46 66.42,40.64 40.51,31.62 22.61,38.99 28.07,17.53 6.48,24.77 6.86,71.37 3.07,50.34 24.26,49.15 16.38,59.82 17.91,50.67 56.01,19.56 50.04,31.5 76.83,14.22 30.73,49.53 87.63,11.56 89.66,8.76 79.76,1.91 78.74,6.99 91.95,8 98.04,10.03 98.3,13.84 91.19,5.21 82.8,4.95 81.28,3.43 82.8,3.43 77.34,41.02 78.87,42.55 91.19,3.17 85.6,11.81
  pour Top (isolate 0.305): -0.76,80.77 33.78,80.77 33.65,43.2 87.38,43.2 87.38,56.9 100.08,56.9 99.69,28.57 79.88,28.57 79.88,-0.76 -0.76,-0.76
  pour Bottom (isolate 0.305): -0.76,80.77 33.78,80.77 33.65,43.2 87.38,43.2 87.38,56.9 100.08,56.9 99.69,32.13 99.82,32.13 99.69,0 -0.76,-0.76
  pour Top (isolate 0.305): 83.19,15.11 83.19,10.79 88.9,10.79 88.9,-0.64 100.33,-0.64 100.33,15.11
  pour Top (isolate 0.305): 80.01,7.62 85.09,7.62 85.09,2.54 85.09,0 79.38,0 79.38,7.62
  pour Top: 95.25,32.38 95.25,11.43 100.33,11.43 100.33,33.02 95.25,33.02
N$1
  Top 0.254: U1_TQFP.7 76.45,37.46 73.66,34.67 66.42,34.67 Q1.2
  Top 0.406: Q1.2 64.52,30.61 64.26,30.35 64.26,29.5 C4.1
N$2
  Top 0.406: R19.1 45.09,66.04 R5.2
  Top 1.27: CT1.1 41.17,69.32 41.91,68.58 41.91,66.83 R7.2 R5.2
N$3
  Top 0.254: R9.1 66.04,66.68 66.04,66.67 65.41,66.04
  Top 0.406: R22.1 63.5,64.14 63.92,63.72 C13.1 | R23.1 R21.1 69.43,63.92 68.58,64.77 66.67,64.77 65.41,66.04
  Top 1.27: CT3.5 62.53,67.65 R22.1 R9.1
N$4
  Top 0.254: R14.1 R13.2
  Top 0.406: R28.2 75.18,50.8 73.66,52.32 R14.1
N$5  (via drill 0.5)
  Top 0.508: U$11.3 12.06,52.38 12.06,45.72 13.34,44.45 v15.24,44.45
  Bottom 0.508: 5.08,44.45 4.62,43.99 JP2.1
  Bottom 0.762: v15.24,44.45 5.08,44.45
N$6
  Top 0.889: R29.2 20.17,54.13 19.68,54.61 19.68,55.88 | 19.68,55.88 C18.+ | U$11.1 16.74,55.47 17.14,55.88 19.68,55.88
N$7
  Top 0.406: R13.1 68.38,55.46 C17.1
N$8
  Top 0.254: R18.2 86.36,66.68
  Top 0.406: R26.1 89.53,66.04 R16.2
  Top 1.27: CT4.1 85.44,69.5 86.36,68.58 86.36,66.83 R18.2 R16.2 | 86.36,66.68 86.36,66.67 87,66.67
N$9
  Top 0.254: Q1.1 74.17,34.01 U1_TQFP.8
  Top 0.406: C11.1 74.38,32.55 Q1.1
N$10
  Top 0.254: R8.2 55.88,66.68 55.88,66.67
  Top 0.406: R20.1 59.05,66.04 R3.2
  Top 1.27: CT2.1 54.27,70.19 55.88,68.58 55.88,66.83 R8.2 R3.2
N$11
  Top 0.406: 80.26,5.75 ANT1.1
  Top 1.143: C29.2 arc90 80.26,5.75
N$12
  Top 0.889: R29.1 D1.1
N$13
  Top 0.254: 68.58,66.83 68.58,66.67
  Top 0.406: 71.54,66.26 R22.2 71.75,66.04 R25.1
  Top 1.27: CT3.1 67.63,69.53 68.58,68.58 68.58,66.83 R9.2 R22.2
N$17
  pour Top: 98.55,71.75 94.74,71.75 94.74,68.58 98.81,68.58 98.81,71.75
N$20  (via drill 0.5)
  Top 0.203: v82.8,45.97 81.49,44.66 U1_TQFP.20 81.36,44.66 | v91.69,53.72 89.57,53.72 C8.1
  Bottom 0.203: v91.69,53.72 90.04,52.07 87.88,52.07 82.8,46.99 v82.8,45.97
N$23
  Top 0.203: C2.2 49.53,10.92 49.12,10.51 48.36,10.51 47.62,9.78 JP1.DTR
  Bottom 0.203: JP1.DTR 47.62,27.28 45.4,29.5 45.4,38.34 JP3.DTR
N$24
  Top 1.143: R31.2 arc-90 87,7.2 J$1.SIG
  Top 1.27: J$1.SIG 87,6.49
N$33
  Top 0.406: R3.1 50.8,64.14 51.22,63.72 C12.1 | R8.1 53.19,65.56 53.98,64.77 55.88,64.77 56.73,63.92 R2.1 R4.1
  Top 1.27: CT2.5 49.16,68.31 R3.1 R8.1
N$34
  Top 0.254: 73.66,55.24 74.55,55.24 74.93,54.86 74.93,53.98 75.06,53.85 76.11,53.85 R11.1
  Top 0.406: R14.2 73.66,55.24 | R11.1 R12.2 C15.1
N$37
  Top 0.406: R16.1 81.28,64.14 81.7,63.72 C14.1 | R18.1 83.67,65.56 84.45,64.77 86.36,64.77 87.21,63.92 R15.1 R17.1
  Top 1.27: R18.1 R16.1 80.34,67.62 CT4.5
N$38
  Top 0.254: R7.1 39.37,66.68 39.37,66.67
  Top 0.406: R5.1 36.83,64.14 37.25,63.72 C9.1 | R7.1 39.22,65.56 40.01,64.77 41.91,64.77 42.76,63.92 R1.1 R6.1
  Top 1.27: CT1.5 36.07,67.44 R5.1 R7.1
N$41  (via drill 0.5)
  Top 0.254: LED1.A 20.95,76.07 v19.81,74.93 | v36.83,55.37 36.83,54.4 R10.1
  Bottom 0.254: v19.81,74.93 19.81,69.98 23.24,66.55 23.24,62.87 26.04,60.07 32.13,60.07 v36.83,55.37
RESET  (via drill 0.5)
  Top 0.203: ISP1.5 92.71,43.18 | 84.96,52.58 94.49,52.58 96.27,50.8 96.27,46.74 | 84.96,52.58 84.45,53.09 R32.1 | 74.84,44.66 U1_TQFP.29 74.11,45.34 71.12,45.34 v70.74,45.72 | S1.2 42.8,6.4 44.2,7.8 44.2,9.27 48.51,13.59 49.49,13.59 | 49.49,13.59 C2.1 | v83.82,51.18 83.82,51.44 84.96,52.58 | 49.49,13.59 49.49,14.95 50.55,16 v59.94,16
  Top 0.254: 92.71,43.18 96.27,46.74
  Bottom 0.203: 72.52,45.34 71.12,45.34 v70.74,45.72 | v83.82,51.18 80.39,51.18 74.33,45.12 71.34,45.12 v70.74,45.72 | v70.74,45.72 61.83,45.72 59.8,43.69 59.8,19.16 59.77,18.88 59.77,18.21 59.94,17.78 v59.94,16

### Text on the board
Bottom: OpenEnergyMonitor.org
bPlace: Designed in | North Wales | Made in UK | 175mm ant | 433Mhz | 87mm ant | V3.4.5 | emonTx | 868Mhz | 78mm ant | 915Mhz | wireless energy monitoring node | Node ID: | Technology that helps us live within ecological limits | Designed in North Wales UK by Glyn Hudson & Trystan Lea | Open-Hardware | OpenEnergyMonitor.org | 5V | 3.3V | GND | Dig3 / IRQ1 | ADC5/Dig19 / DS18B20 PWR | Dig 5 PWM / DS18B20 Data | 1 | 2 | 3 | 4 | 5 | 6 | Lead free PCB - RoHS components
tNames: LED | 2.1MM | 5V USB | 4.5kW MAX | 9V AC | CT 1-3 / 23kW MAX | @240V | 4.5kW / MAX / @240V | Front Act LED / Dig 6 PWM | D9 | D8 | emonTx | 2 / / 1 | V3.4.5 | JP2 AC-DC Power Supply / Enable - 20mA MAX | RST | Tx | Rx | 5V | GND | 3 x AA / Battery | Wireless / Energy / Monitoring / Node | RFM69CW | 5V | 3.3V | GND | IRQ1 Dig3 | ADC5 / Dig19 /DS18B20 PWR | Dig 5 / DS18B20 Data / PWM | 1 | 2 | 3 | 4 | 5 | 6 | RST | Rx | Tx | 5V | GND | UART | Reset | Programming Header
_tsilk: Designed in | North Wales | Made in UK
_bsilk: SMT V0.6 rev3 | emonTx | wireless energy monitoring node | SMT V0.6 rev3 | emonTx | SMT V0.6 rev3 | emonTx | Technology that helps us live within ecological limits | wireless energy monitoring node | wireless energy monitoring node | Designed in North Wales UK by Glyn Hudson & Trystan Lea | Technology that helps us live within ecological limits | Technology that helps us live within ecological limits | Designed in North Wales UK by Glyn Hudson & Trystan Lea | 165mm ant | 433Mhz | Designed in North Wales UK by Glyn Hudson & Trystan Lea | 165mm ant | 165mm ant | 433Mhz | 433Mhz | 868Mhz | 82mm ant | 82mm ant | 82mm ant | 868Mhz | 868Mhz | 78mm ant | 915Mhz | 78mm ant | 915Mhz | 78mm ant | 915Mhz | 165mm ant | 433Mhz | 82mm ant | 868Mhz | 78mm ant | 915Mhz